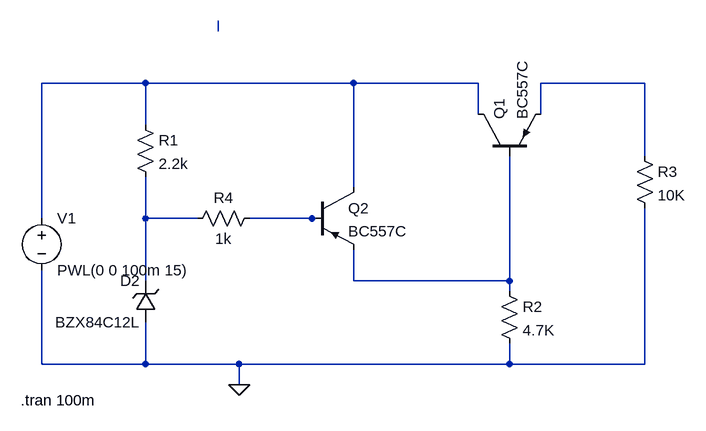
[diagram p0: schematic pnp.asc]
pnp.asc, the LTspice schematic file:
Version 4.1
SHEET 1 932 680
WIRE 208 -208 208 -224
WIRE 96 -128 -64 -128
WIRE 416 -128 96 -128
WIRE 608 -128 416 -128
WIRE 864 -128 704 -128
WIRE 608 -80 608 -128
WIRE 704 -80 704 -128
WIRE 96 -64 96 -128
WIRE 864 -16 864 -128
WIRE 416 32 416 -128
WIRE -64 80 -64 -128
WIRE 96 80 96 16
WIRE 176 80 96 80
WIRE 352 80 256 80
WIRE 368 80 352 80
WIRE 96 176 96 80
WIRE 416 176 416 128
WIRE 656 176 656 -16
WIRE 656 176 416 176
WIRE 656 192 656 176
WIRE -64 304 -64 160
WIRE 96 304 96 240
WIRE 96 304 -64 304
WIRE 240 304 96 304
WIRE 656 304 656 272
WIRE 656 304 240 304
WIRE 864 304 864 64
WIRE 864 304 656 304
WIRE 240 336 240 304
FLAG 240 336 0
SYMBOL voltage -64 64 R0
WINDOW 123 0 0 Left 0
WINDOW 39 0 0 Left 0
SYMATTR InstName V1
SYMATTR Value PWL(0 0 100m 15)
SYMBOL res 80 -80 R0
SYMATTR InstName R1
SYMATTR Value 2.2k
SYMBOL res 640 176 R0
SYMATTR InstName R2
SYMATTR Value 4.7K
SYMBOL res 848 -32 R0
SYMATTR InstName R3
SYMATTR Value 10K
SYMBOL res 272 64 R90
WINDOW 0 0 56 VBottom 2
WINDOW 3 32 56 VTop 2
SYMATTR InstName R4
SYMATTR Value 1k
SYMBOL zener 112 240 R180
WINDOW 0 24 64 Left 2
WINDOW 3 24 0 Left 2
SYMATTR InstName D2
SYMATTR Value BZX84C12L
SYMBOL pnp 608 -16 R270
SYMATTR InstName Q1
SYMATTR Value BC557C
SYMBOL pnp 352 32 R0
SYMATTR InstName Q2
SYMATTR Value BC557C
TEXT -96 360 Left 2 !.tran 100m

The netlist it stands for:
* pnp.asc
V1 N002 0 PWL(0 0 100m 15)
R1 N002 N004 2.2k
R2 N006 0 4.7K
R3 N003 0 10K
R4 N005 N004 1k
D2 0 N004 BZX84C12L
Q1 N002 N006 N003 0 BC557C
Q2 N002 N005 N006 0 BC557C
.model D D
.lib standard.dio
.model NPN NPN
.model PNP PNP
.lib standard.bjt
.tran 100m
.backanno
.end